# Altium schematic sheet Receiver.SchDoc
size A4
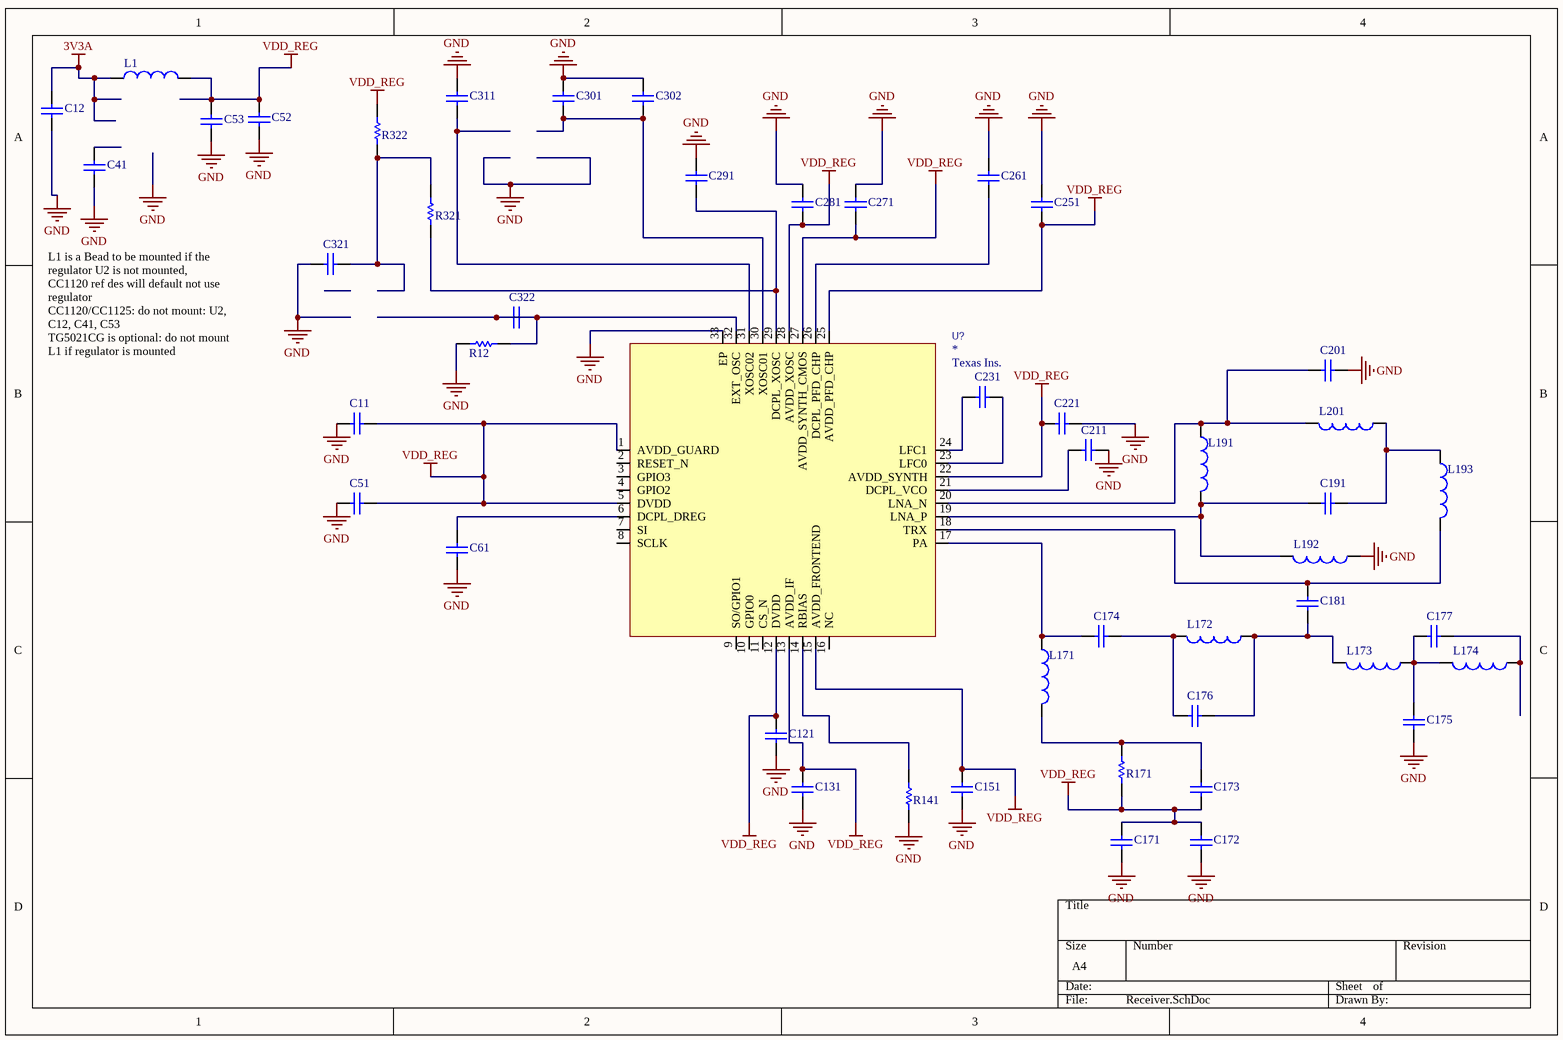
[diagram p0: Receiver.SchDoc]

## Parts
C11  CAPACITOR (GENERAL)  [C0805]  (value not drawn)
C12  CAPACITOR (GENERAL)  [C0805]  (value not drawn)
C41  CAPACITOR (GENERAL)  [C0805]  (value not drawn)
C51  CAPACITOR (GENERAL)  [C0805]  (value not drawn)
C52  CAPACITOR (GENERAL)  [C0805]  (value not drawn)
C53  CAPACITOR (GENERAL)  [C0805]  (value not drawn)
C61  CAPACITOR (GENERAL)  [C0805]  (value not drawn)
C121  CAPACITOR (GENERAL)  [C0805]  (value not drawn)
C131  CAPACITOR (GENERAL)  [C0805]  (value not drawn)
C151  CAPACITOR (GENERAL)  [C0805]  (value not drawn)
C171  CAPACITOR (GENERAL)  [C0805]  (value not drawn)
C172  CAPACITOR (GENERAL)  [C0805]  (value not drawn)
C173  CAPACITOR (GENERAL)  [C0805]  (value not drawn)
C174  CAPACITOR (GENERAL)  [C0805]  (value not drawn)
C175  CAPACITOR (GENERAL)  [C0805]  (value not drawn)
C176  CAPACITOR (GENERAL)  [C0805]  (value not drawn)
C177  CAPACITOR (GENERAL)  [C0805]  (value not drawn)
C181  CAPACITOR (GENERAL)  [C0805]  (value not drawn)
C191  CAPACITOR (GENERAL)  [C0805]  (value not drawn)
C201  CAPACITOR (GENERAL)  [C0805]  (value not drawn)
C211  CAPACITOR (GENERAL)  [C0805]  (value not drawn)
C221  CAPACITOR (GENERAL)  [C0805]  (value not drawn)
C231  CAPACITOR (GENERAL)  [C0805]  (value not drawn)
C251  CAPACITOR (GENERAL)  [C0805]  (value not drawn)
C261  CAPACITOR (GENERAL)  [C0805]  (value not drawn)
C271  CAPACITOR (GENERAL)  [C0805]  (value not drawn)
C281  CAPACITOR (GENERAL)  [C0805]  (value not drawn)
C291  CAPACITOR (GENERAL)  [C0805]  (value not drawn)
C301  CAPACITOR (GENERAL)  [C0805]  (value not drawn)
C302  CAPACITOR (GENERAL)  [C0805]  (value not drawn)
C311  CAPACITOR (GENERAL)  [C0805]  (value not drawn)
C321  CAPACITOR (GENERAL)  [C0805]  (value not drawn)
C322  CAPACITOR (GENERAL)  [C0805]  (value not drawn)
L1  INDUCTOR (GENERAL)  [0402-A]  (value not drawn)
L171  INDUCTOR (GENERAL)  [0402-A]  (value not drawn)
L172  INDUCTOR (GENERAL)  [0402-A]  (value not drawn)
L173  INDUCTOR (GENERAL)  [0402-A]  (value not drawn)
L174  INDUCTOR (GENERAL)  [0402-A]  (value not drawn)
L191  INDUCTOR (GENERAL)  [0402-A]  (value not drawn)
L192  INDUCTOR (GENERAL)  [0402-A]  (value not drawn)
L193  INDUCTOR (GENERAL)  [0402-A]  (value not drawn)
L201  INDUCTOR (GENERAL)  [0402-A]  (value not drawn)
R12  RESISTOR (GENERAL)  (value not drawn)
R141  RESISTOR (GENERAL)  (value not drawn)
R171  RESISTOR (GENERAL)  (value not drawn)
R321  RESISTOR (GENERAL)  (value not drawn)
R322  RESISTOR (GENERAL)  (value not drawn)
U?  Manufacturer: Texas Ins.  (hidden comment: CC1120)

## Nets
3V3A: C12.1 L1.1
GND: C11.2 C12.2 C41.2 C51.2 C52.2 C53.2 C61.2 C121.2 C131.2 C151.2 C171.1 C172.1 C175.2 C201.2 C211.2 C221.2 C251.2 C261.2 C271.2 C281.2 C291.2 C301.2 C302.2 C311.2 C321.2 L192.1 R12.1 R141.1 U?.33(EP)
VDD_REG: C11.1 C51.1 C52.1 C53.1 C121.1 C131.1 C151.1 C171.2 C172.2 C173.1 C221.1 C251.1 C271.1 C281.1 L1.2 R171.1 R322.2 U?.1(AVDD_GUARD) U?.5(DVDD) U?.12(DVDD) U?.13(AVDD_IF) U?.15(AVDD_FRONTEND) U?.22(AVDD_SYNTH) U?.25(AVDD_PFD_CHP) U?.27(AVDD_SYNTH_CMOS) U?.28(AVDD_XOSC)
NetC61_1: C61.1 U?.6(DCPL_DREG)
NetC173_2: C173.2 L171.2 R171.2
NetC174_1: C174.1 C176.2 L172.2
NetC174_2: C174.2 L171.1 U?.17(PA)
NetC175_1: C175.1 C177.2 L173.1 L174.2
NetC176_1: C176.1 C181.1 L172.1 L173.2
NetC177_1: C177.1 L174.1
NetC181_2: C181.2 L193.2 U?.18(TRX)
NetC191_1: C191.1 L191.2 L192.2 U?.19(LNA_P)
NetC191_2: C191.2 L193.1 L201.1
NetC201_1: C201.1 L191.1 L201.2 U?.20(LNA_N)
NetC211_1: C211.1 U?.21(DCPL_VCO)
NetC231_1: C231.1 U?.23(LFC0)
NetC231_2: C231.2 U?.24(LFC1)
NetC261_1: C261.1 U?.26(DCPL_PFD_CHP)
NetC291_1: C291.1 R321.2 U?.29(DCPL_XOSC)
NetC301_1: C301.1 C302.1 U?.30(XOSC01)
NetC311_1: C311.1 U?.31(XOSC02)
NetC321_1: C321.1 R321.1 R322.1
NetC322_1: C322.1 C322.2 R12.2 U?.32(EXT_OSC)
NetR141_2: R141.2 U?.14(RBIAS)

Not connected (* = marked no-connect by the designer): C41 1; U? 2(RESET_N) 3(GPIO3) 4(GPIO2) 7(SI) 8(SCLK) 9(SO/GPIO1) 10(GPIO0) 11(CS_N) 16(NC)

## Notes on the sheet
- L1 is a Bead to be mounted if the regulator U2 is not mounted,
  CC1120 ref des will default not use regulator
  CC1120/CC1125: do not mount: U2, C12, C41, C53
  TG5021CG is optional: do not mount L1 if regulator is mounted

## Library data of the parts
C11 C12 C41 C51-C53 C61 C121 C131 C151 C171-C177 C181 C191 C201 C211 C221 C231 C251 C261 C271 C281 C291 C301 C302 C311 C321 C322 = CAPACITOR (GENERAL): Capacitor; Supplier 1: Digi-Key; Supplier Part Number 1: *; Value: *
L1 L171-L174 L191-L193 L201 = INDUCTOR (GENERAL): Inductor; Supplier 1: Digi-Key; Supplier Part Number 1: *; Value: *
R12 R141 R171 R321 R322 = RESISTOR (GENERAL): Resistor; Supplier 1: Digi-Key; Supplier Part Number 1: TBD; Value: *
U? = CC1120: Distributor: Digi-Key; Distributor Part Number: *; Manufacturer Part Number: *